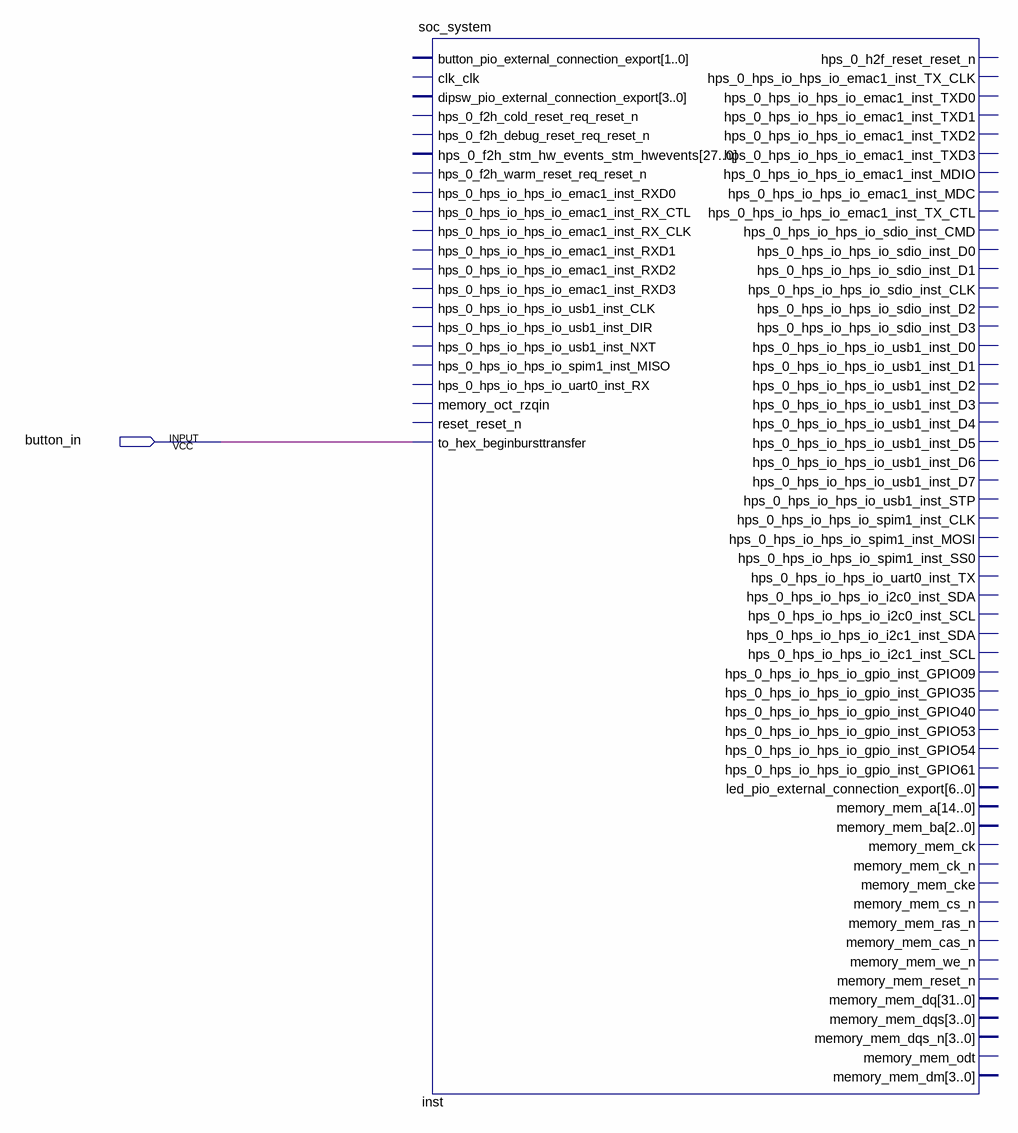
[diagram p0: schematic sheet]
// Quartus schematic DE10_NANO_SoC_GHRD.bdf as structural Verilog: 1 symbols, 1 pins
module DE10_NANO_SoC_GHRD (
  input  button_in
);

  soc_system inst (.to_hex_beginbursttransfer(button_in));  // open: button_pio_external_connection_export, clk_clk, dipsw_pio_external_connection_export, hps_0_f2h_cold_reset_req_reset_n, hps_0_f2h_debug_reset_req_reset_n, hps_0_f2h_stm_hw_events_stm_hwevents, hps_0_f2h_warm_reset_req_reset_n, hps_0_hps_io_hps_io_emac1_inst_RXD0, hps_0_hps_io_hps_io_emac1_inst_RX_CTL, hps_0_hps_io_hps_io_emac1_inst_RX_CLK, hps_0_hps_io_hps_io_emac1_inst_RXD1, hps_0_hps_io_hps_io_emac1_inst_RXD2, hps_0_hps_io_hps_io_emac1_inst_RXD3, hps_0_hps_io_hps_io_usb1_inst_CLK, hps_0_hps_io_hps_io_usb1_inst_DIR, hps_0_hps_io_hps_io_usb1_inst_NXT, hps_0_hps_io_hps_io_spim1_inst_MISO, hps_0_hps_io_hps_io_uart0_inst_RX, memory_oct_rzqin, reset_reset_n, hps_0_h2f_reset_reset_n, hps_0_hps_io_hps_io_emac1_inst_TX_CLK, hps_0_hps_io_hps_io_emac1_inst_TXD0, hps_0_hps_io_hps_io_emac1_inst_TXD1, hps_0_hps_io_hps_io_emac1_inst_TXD2, hps_0_hps_io_hps_io_emac1_inst_TXD3, hps_0_hps_io_hps_io_emac1_inst_MDC, hps_0_hps_io_hps_io_emac1_inst_TX_CTL, hps_0_hps_io_hps_io_sdio_inst_CLK, hps_0_hps_io_hps_io_usb1_inst_STP, hps_0_hps_io_hps_io_spim1_inst_CLK, hps_0_hps_io_hps_io_spim1_inst_MOSI, hps_0_hps_io_hps_io_spim1_inst_SS0, hps_0_hps_io_hps_io_uart0_inst_TX, led_pio_external_connection_export, memory_mem_a, memory_mem_ba, memory_mem_ck, memory_mem_ck_n, memory_mem_cke, memory_mem_cs_n, memory_mem_ras_n, memory_mem_cas_n, memory_mem_we_n, memory_mem_reset_n, memory_mem_odt, memory_mem_dm, hps_0_hps_io_hps_io_emac1_inst_MDIO, hps_0_hps_io_hps_io_sdio_inst_CMD, hps_0_hps_io_hps_io_sdio_inst_D0, hps_0_hps_io_hps_io_sdio_inst_D1, hps_0_hps_io_hps_io_sdio_inst_D2, hps_0_hps_io_hps_io_sdio_inst_D3, hps_0_hps_io_hps_io_usb1_inst_D0, hps_0_hps_io_hps_io_usb1_inst_D1, hps_0_hps_io_hps_io_usb1_inst_D2, hps_0_hps_io_hps_io_usb1_inst_D3, hps_0_hps_io_hps_io_usb1_inst_D4, hps_0_hps_io_hps_io_usb1_inst_D5, hps_0_hps_io_hps_io_usb1_inst_D6, hps_0_hps_io_hps_io_usb1_inst_D7, hps_0_hps_io_hps_io_i2c0_inst_SDA, hps_0_hps_io_hps_io_i2c0_inst_SCL, hps_0_hps_io_hps_io_i2c1_inst_SDA, hps_0_hps_io_hps_io_i2c1_inst_SCL, hps_0_hps_io_hps_io_gpio_inst_GPIO09, hps_0_hps_io_hps_io_gpio_inst_GPIO35, hps_0_hps_io_hps_io_gpio_inst_GPIO40, hps_0_hps_io_hps_io_gpio_inst_GPIO53, hps_0_hps_io_hps_io_gpio_inst_GPIO54, hps_0_hps_io_hps_io_gpio_inst_GPIO61, memory_mem_dq, memory_mem_dqs, memory_mem_dqs_n
endmodule
